# Altium schematic sheet Reid Orthotic v2 MUX.SchDoc: CAL1020 MCU
size A4; DrawnBy: Alex Gilmour; DocumentNumber: 4; Revision: v2; SheetNumber: 4; SheetTotal: 5; PageSetup: Record=PageOptions|CenterHorizontal=True|CenterVertical=True|PrintScale=0.73|XCorrection=1.00|YCorrection=1.00|PrintKind=0|BorderSize=5000000|LeftOffset=0|BottomOffset=0|Orientation=2|PaperLength=1000|PaperWidth=1000|Scale=100|PaperSource=7|PrintQuality=-3|MediaType=1|DitherType=10|PrintScaleMode=1|PaperKind=A4|PaperIndex=9
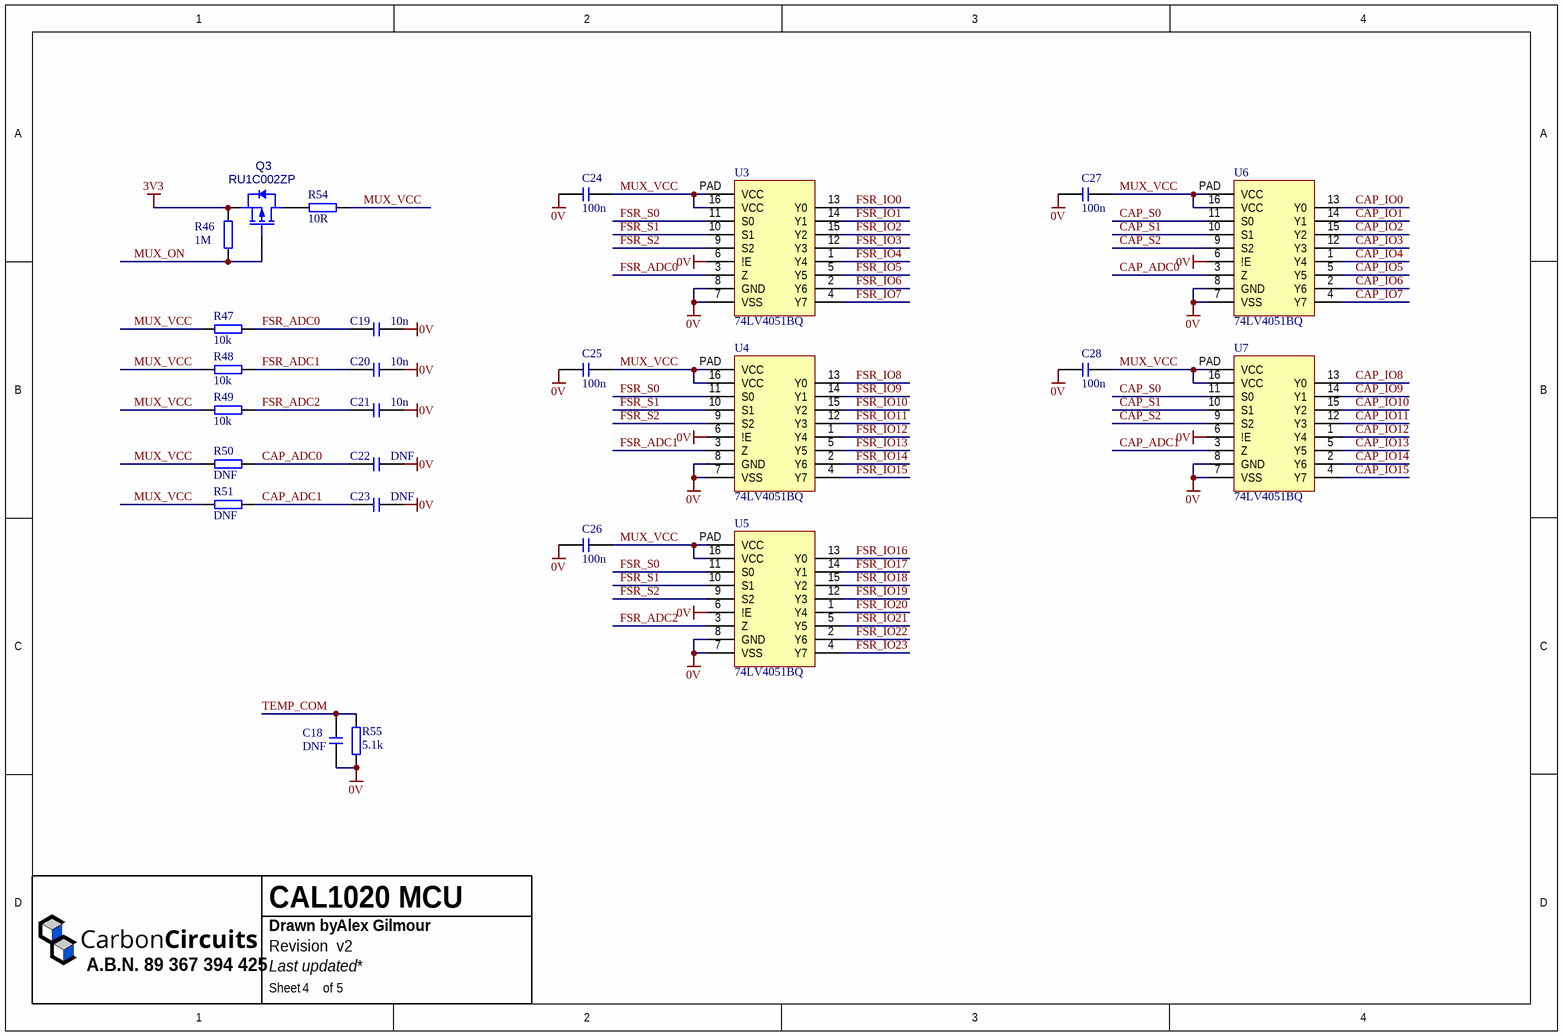
[diagram p0: Reid Orthotic v2 MUX.SchDoc]

## Parts
C18  DNF  [0402 CAP HD]
C19  10n  [0402 CAP HD]
C20  10n  [0402 CAP HD]
C21  10n  [0402 CAP HD]
C22  DNF  [0402 CAP HD]
C23  DNF  [0402 CAP HD]
C24  100n  [0402 CAP HD]
C25  100n  [0402 CAP HD]
C26  100n  [0402 CAP HD]
C27  100n  [0402 CAP HD]
C28  100n  [0402 CAP HD]
Q3  RU1C002ZP  [SOT323]
R46  1M  [0402 RES HD]
R47  10k  [0402 RES HD]
R48  10k  [0402 RES HD]
R49  10k  [0402 RES HD]
R50  DNF  [0402 RES HD]
R51  DNF  [0402 RES HD]
R54  10R  [0603 RES HD]
R55  5.1k  [0402 RES HD]
U3  74LV4051BQ  [74LV4051BQ]
U4  74LV4051BQ  [74LV4051BQ]
U5  74LV4051BQ  [74LV4051BQ]
U6  74LV4051BQ  [74LV4051BQ]
U7  74LV4051BQ  [74LV4051BQ]

## Nets
0V: C18.2 C19.2 C20.2 C21.2 C22.2 C23.2 C24.1 C25.1 C26.1 C27.1 C28.1 R55.2 U3.6(!E) U3.7(VSS) U3.8(GND) U4.6(!E) U4.7(VSS) U4.8(GND) U5.6(!E) U5.7(VSS) U5.8(GND) U6.6(!E) U6.7(VSS) U6.8(GND) U7.6(!E) U7.7(VSS) U7.8(GND)
3V3: Q3.2(S) R46.2
CAP_ADC0: C22.1 R50.1 U6.3(Z)
CAP_ADC1: C23.1 R51.1 U7.3(Z)
CAP_IO0: U6.13(Y0)
CAP_IO1: U6.14(Y1)
CAP_IO2: U6.15(Y2)
CAP_IO3: U6.12(Y3)
CAP_IO4: U6.1(Y4)
CAP_IO5: U6.5(Y5)
CAP_IO6: U6.2(Y6)
CAP_IO7: U6.4(Y7)
CAP_IO8: U7.13(Y0)
CAP_IO9: U7.14(Y1)
CAP_IO10: U7.15(Y2)
CAP_IO11: U7.12(Y3)
CAP_IO12: U7.1(Y4)
CAP_IO13: U7.5(Y5)
CAP_IO14: U7.2(Y6)
CAP_IO15: U7.4(Y7)
CAP_S0: U6.11(S0) U7.11(S0)
CAP_S1: U6.10(S1) U7.10(S1)
CAP_S2: U6.9(S2) U7.9(S2)
FSR_ADC0: C19.1 R47.1 U3.3(Z)
FSR_ADC1: C20.1 R48.1 U4.3(Z)
FSR_ADC2: C21.1 R49.1 U5.3(Z)
FSR_IO0: U3.13(Y0)
FSR_IO1: U3.14(Y1)
FSR_IO2: U3.15(Y2)
FSR_IO3: U3.12(Y3)
FSR_IO4: U3.1(Y4)
FSR_IO5: U3.5(Y5)
FSR_IO6: U3.2(Y6)
FSR_IO7: U3.4(Y7)
FSR_IO8: U4.13(Y0)
FSR_IO9: U4.14(Y1)
FSR_IO10: U4.15(Y2)
FSR_IO11: U4.12(Y3)
FSR_IO12: U4.1(Y4)
FSR_IO13: U4.5(Y5)
FSR_IO14: U4.2(Y6)
FSR_IO15: U4.4(Y7)
FSR_IO16: U5.13(Y0)
FSR_IO17: U5.14(Y1)
FSR_IO18: U5.15(Y2)
FSR_IO19: U5.12(Y3)
FSR_IO20: U5.1(Y4)
FSR_IO21: U5.5(Y5)
FSR_IO22: U5.2(Y6)
FSR_IO23: U5.4(Y7)
FSR_S0: U3.11(S0) U4.11(S0) U5.11(S0)
FSR_S1: U3.10(S1) U4.10(S1) U5.10(S1)
FSR_S2: U3.9(S2) U4.9(S2) U5.9(S2)
MUX_ON: Q3.1(G) R46.1
MUX_VCC: C24.2 C25.2 C26.2 C27.2 C28.2 R47.2 R48.2 R49.2 R50.2 R51.2 R54.1 U3.16(VCC) U3.PAD(VCC) U4.16(VCC) U4.PAD(VCC) U5.16(VCC) U5.PAD(VCC) U6.16(VCC) U6.PAD(VCC) U7.16(VCC) U7.PAD(VCC)
TEMP_COM: C18.1 R55.1
NetQ3_3: Q3.3(D) R54.2

## Notes on the sheet
- A.B.N. 89 367 394 425
- Revision
- Drawn by
- Last updated
- Sheet
- of

## Library data of the parts
C18-C28 = Capacitor
Q3 = MOSFET PCH
R46-R51 R54 R55 = Resistor